# Altium schematic sheet GPIO_mcu_plis.SchDoc
size 420 x 297 mm; SheetNumber: 3; SheetTotal: 6
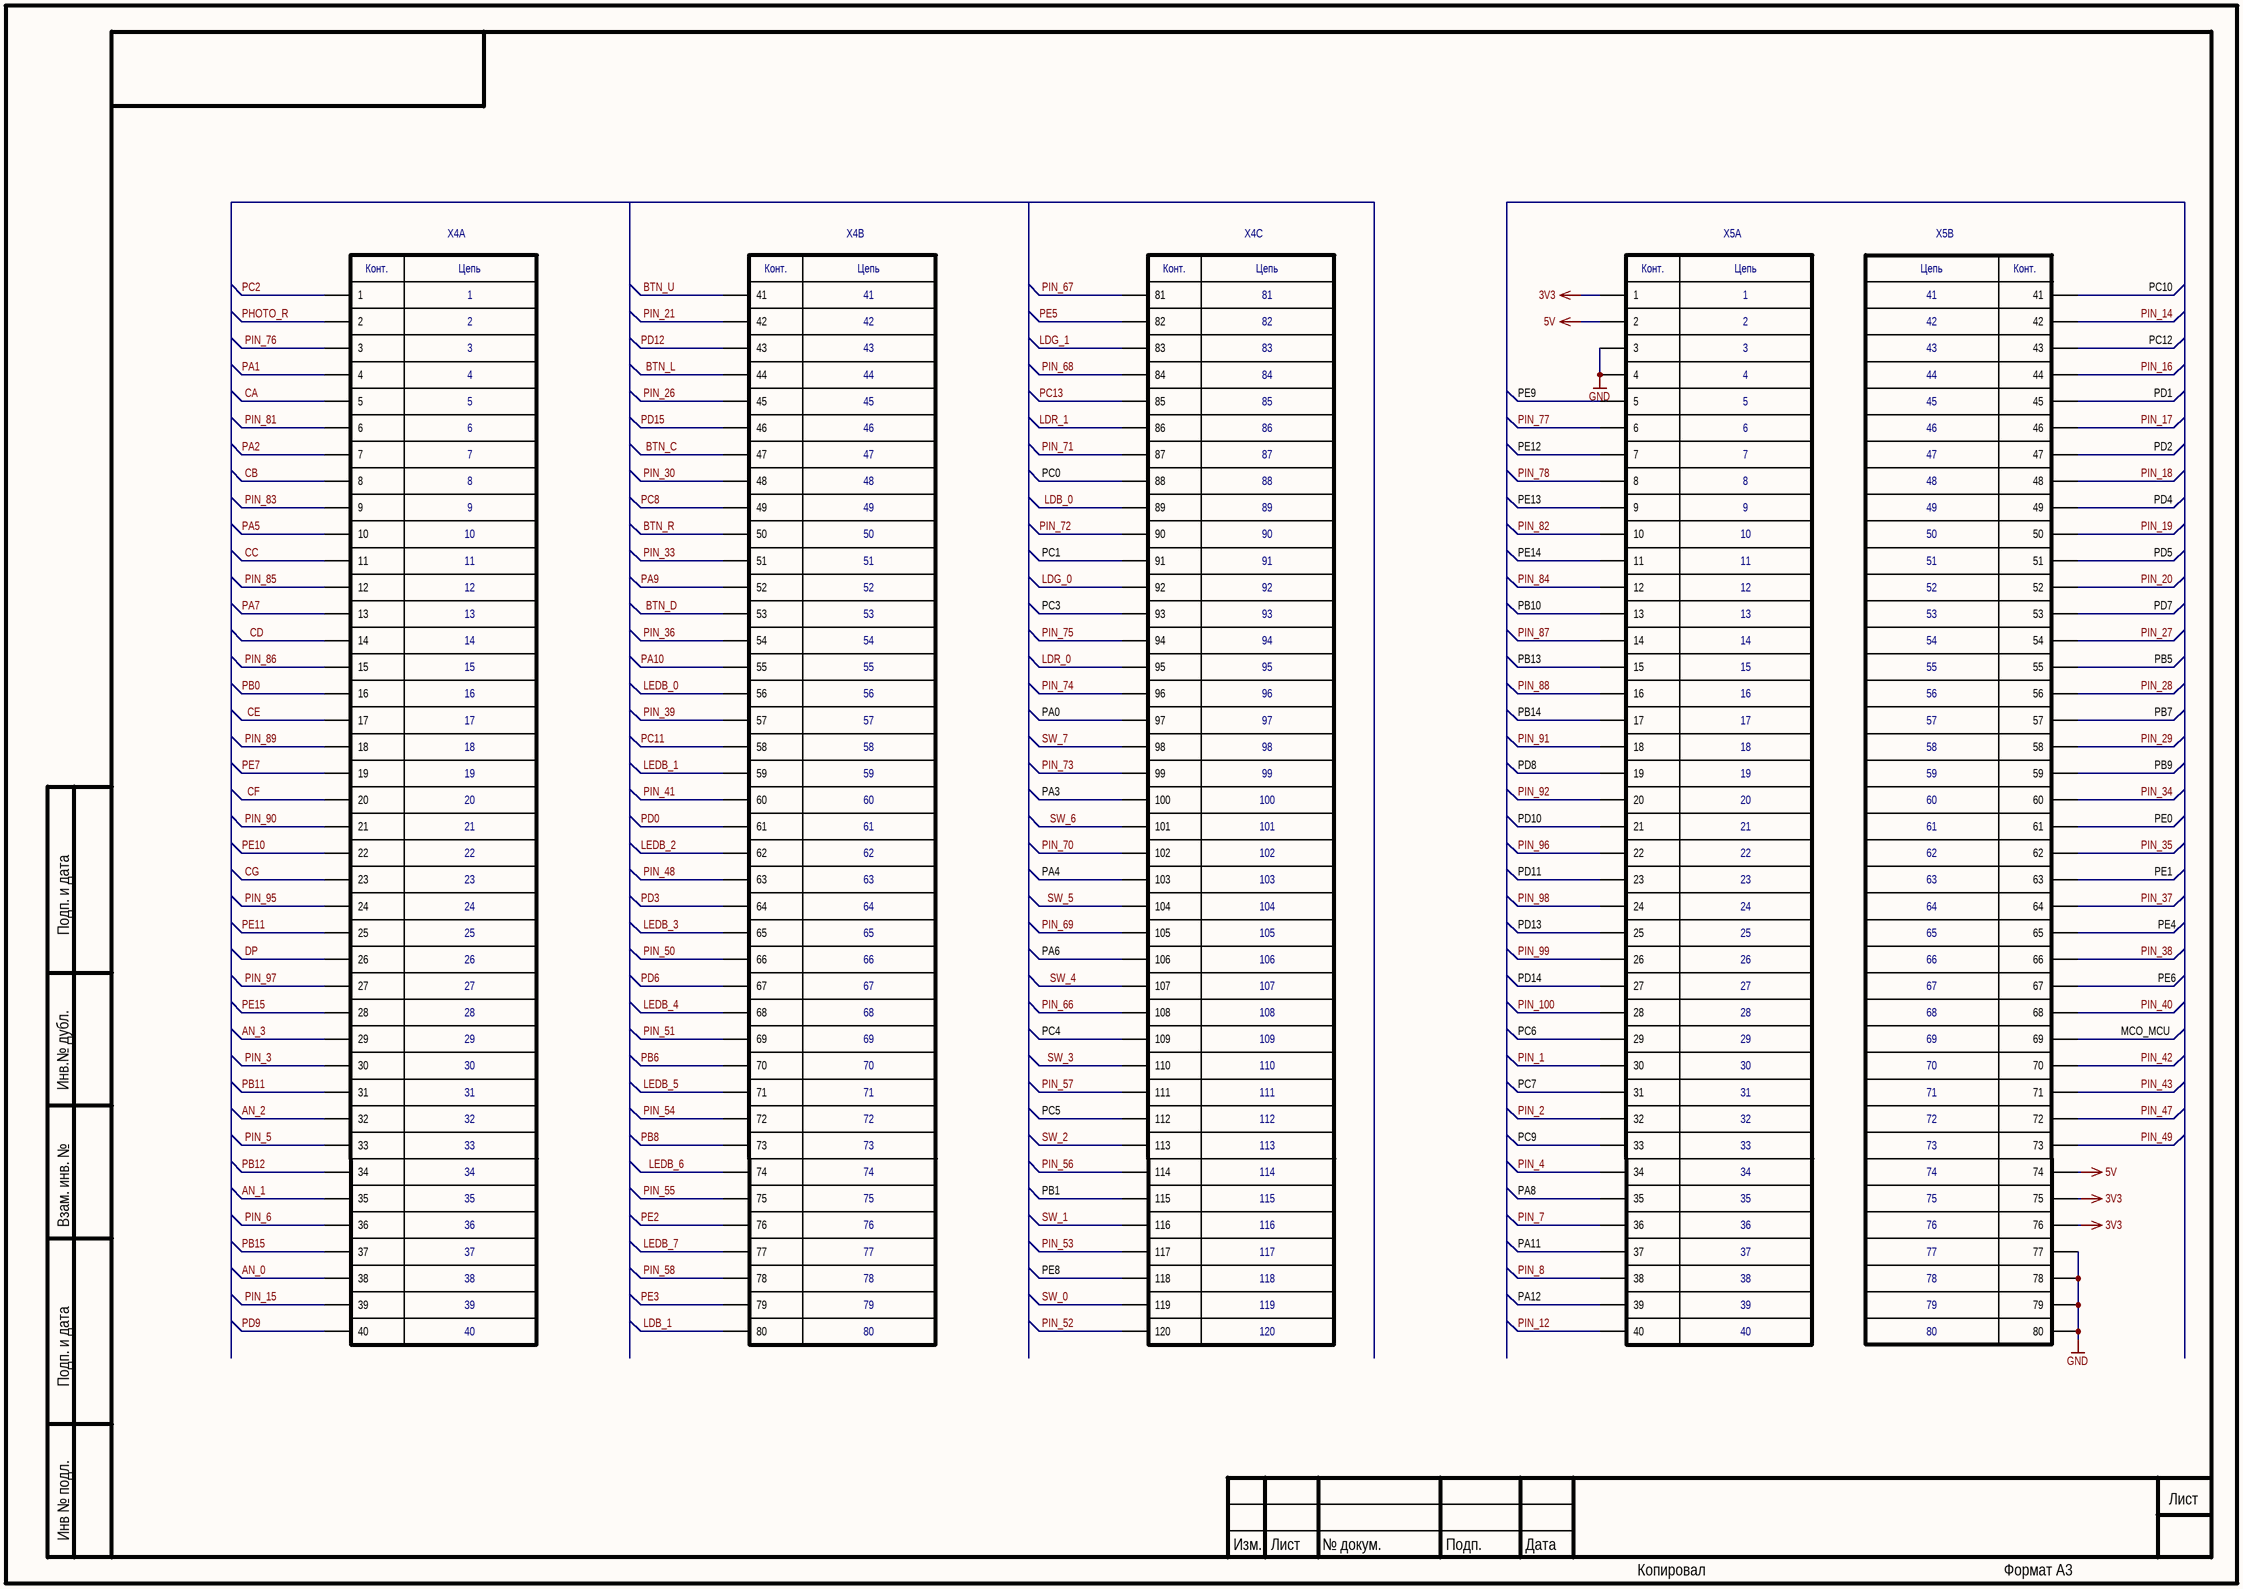
[diagram p0: GPIO_mcu_plis.SchDoc]

## Parts
X4  KONT_POLE_MEZ  [PLT-120]  (value not drawn)  (parts A,B,C of 3)
X5  KONT_POLE_MEZ  [PLD-80]  (value not drawn)  (parts A,B of 2)

## Nets
3V3: X5.1 X5.75 X5.76
5V: X5.2 X5.74
GND: X5.3 X5.4 X5.77 X5.78 X5.79 X5.80
AN_0: X4.38
AN_1: X4.35
AN_2: X4.32
AN_3: X4.29
BTN_C: X4.47
BTN_D: X4.53
BTN_L: X4.44
BTN_R: X4.50
BTN_U: X4.41
CA: X4.5
CB: X4.8
CC: X4.11
CD: X4.14
CE: X4.17
CF: X4.20
CG: X4.23
DP: X4.26
LDB_0: X4.89
LDB_1: X4.80
LDG_0: X4.92
LDG_1: X4.83
LDR_0: X4.95
LDR_1: X4.86
LEDB_0: X4.56
LEDB_1: X4.59
LEDB_2: X4.62
LEDB_3: X4.65
LEDB_4: X4.68
LEDB_5: X4.71
LEDB_6: X4.74
LEDB_7: X4.77
MCO_MCU: X5.69
PA0: X4.97
PA1: X4.4
PA2: X4.7
PA3: X4.100
PA4: X4.103
PA5: X4.10
PA6: X4.106
PA7: X4.13
PA8: X5.35
PA9: X4.52
PA10: X4.55
PA11: X5.37
PA12: X5.39
PB0: X4.16
PB1: X4.115
PB5: X5.55
PB6: X4.70
PB7: X5.57
PB8: X4.73
PB9: X5.59
PB10: X5.13
PB11: X4.31
PB12: X4.34
PB13: X5.15
PB14: X5.17
PB15: X4.37
PC0: X4.88
PC1: X4.91
PC2: X4.1
PC3: X4.93
PC4: X4.109
PC5: X4.112
PC6: X5.29
PC7: X5.31
PC8: X4.49
PC9: X5.33
PC10: X5.41
PC11: X4.58
PC12: X5.43
PC13: X4.85
PD0: X4.61
PD1: X5.45
PD2: X5.47
PD3: X4.64
PD4: X5.49
PD5: X5.51
PD6: X4.67
PD7: X5.53
PD8: X5.19
PD9: X4.40
PD10: X5.21
PD11: X5.23
PD12: X4.43
PD13: X5.25
PD14: X5.27
PD15: X4.46
PE0: X5.61
PE1: X5.63
PE2: X4.76
PE3: X4.79
PE4: X5.65
PE5: X4.82
PE6: X5.67
PE7: X4.19
PE8: X4.118
PE9: X5.5
PE10: X4.22
PE11: X4.25
PE12: X5.7
PE13: X5.9
PE14: X5.11
PE15: X4.28
PHOTO_R: X4.2
PIN_1: X5.30
PIN_2: X5.32
PIN_3: X4.30
PIN_4: X5.34
PIN_5: X4.33
PIN_6: X4.36
PIN_7: X5.36
PIN_8: X5.38
PIN_12: X5.40
PIN_14: X5.42
PIN_15: X4.39
PIN_16: X5.44
PIN_17: X5.46
PIN_18: X5.48
PIN_19: X5.50
PIN_20: X5.52
PIN_21: X4.42
PIN_26: X4.45
PIN_27: X5.54
PIN_28: X5.56
PIN_29: X5.58
PIN_30: X4.48
PIN_33: X4.51
PIN_34: X5.60
PIN_35: X5.62
PIN_36: X4.54
PIN_37: X5.64
PIN_38: X5.66
PIN_39: X4.57
PIN_40: X5.68
PIN_41: X4.60
PIN_42: X5.70
PIN_43: X5.71
PIN_47: X5.72
PIN_48: X4.63
PIN_49: X5.73
PIN_50: X4.66
PIN_51: X4.69
PIN_52: X4.120
PIN_53: X4.117
PIN_54: X4.72
PIN_55: X4.75
PIN_56: X4.114
PIN_57: X4.111
PIN_58: X4.78
PIN_66: X4.108
PIN_67: X4.81
PIN_68: X4.84
PIN_69: X4.105
PIN_70: X4.102
PIN_71: X4.87
PIN_72: X4.90
PIN_73: X4.99
PIN_74: X4.96
PIN_75: X4.94
PIN_76: X4.3
PIN_77: X5.6
PIN_78: X5.8
PIN_81: X4.6
PIN_82: X5.10
PIN_83: X4.9
PIN_84: X5.12
PIN_85: X4.12
PIN_86: X4.15
PIN_87: X5.14
PIN_88: X5.16
PIN_89: X4.18
PIN_90: X4.21
PIN_91: X5.18
PIN_92: X5.20
PIN_95: X4.24
PIN_96: X5.22
PIN_97: X4.27
PIN_98: X5.24
PIN_99: X5.26
PIN_100: X5.28
SW_0: X4.119
SW_1: X4.116
SW_2: X4.113
SW_3: X4.110
SW_4: X4.107
SW_5: X4.104
SW_6: X4.101
SW_7: X4.98

## Notes on the sheet
- Подп. и дата
- Инв.№ дубл.
- Взам. инв. №
- Инв № подл.
- Изм.
- Лист
- № докум.
- Подп.
- Дата
- Копировал
- Формат А3
- (in symbol KONT_POLE_80, part A) Конт.; Цепь
- (in symbol KONT_POLE_80, part B) Цепь; Конт.
- (in symbol KONT_POLE_120, part A) Конт.; Цепь
- (in symbol KONT_POLE_120, part B) Конт.; Цепь
- (in symbol KONT_POLE_120, part C) Конт.; Цепь

## Library data of the parts
X4 = KONT_POLE_120
X5 = KONT_POLE_80